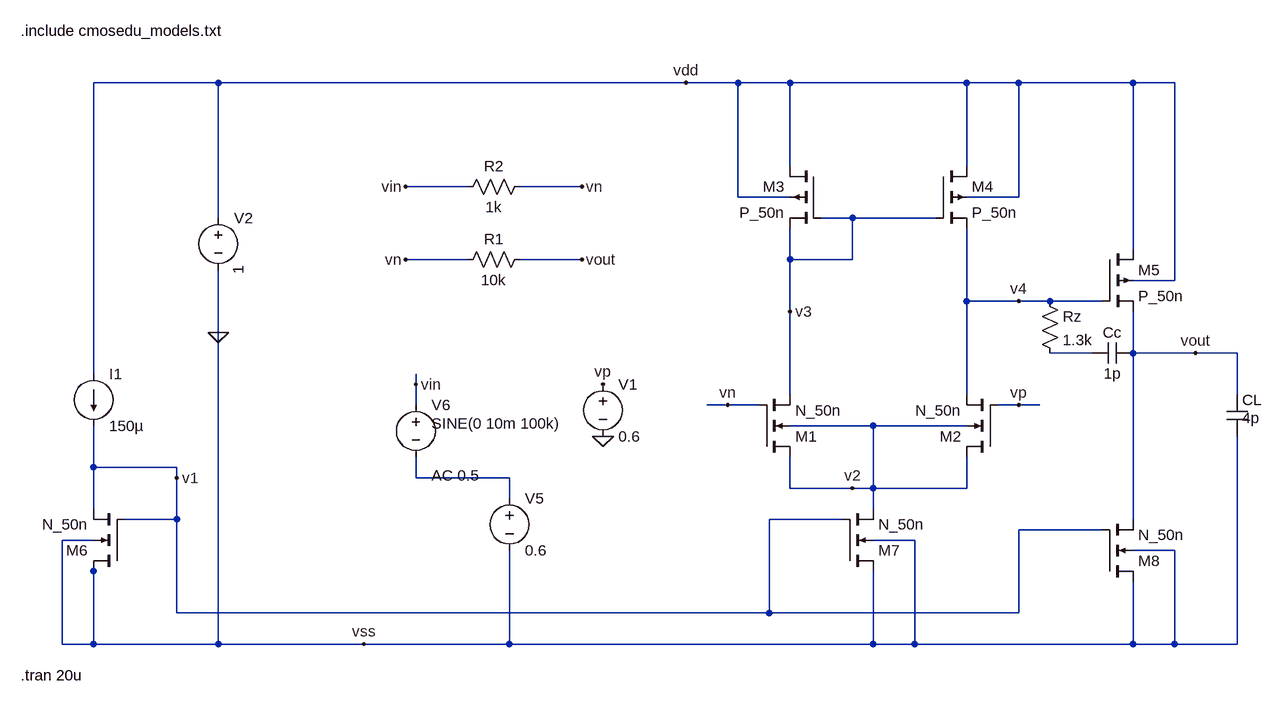
[diagram p0: schematic entregable_23_24_estudiantes.asc]
entregable_23_24_estudiantes.asc, the LTspice schematic file:
Version 4
SHEET 1 1968 1112
WIRE -176 -208 -368 -208
WIRE 544 -208 -176 -208
WIRE 624 -208 544 -208
WIRE 704 -208 624 -208
WIRE 976 -208 704 -208
WIRE 1056 -208 976 -208
WIRE 1232 -208 1056 -208
WIRE 1296 -208 1232 -208
WIRE 704 -80 704 -208
WIRE 976 -80 976 -208
WIRE 208 -48 112 -48
WIRE 384 -48 288 -48
WIRE 624 -32 624 -208
WIRE 704 -32 624 -32
WIRE 1056 -32 1056 -208
WIRE 1056 -32 976 -32
WIRE -176 0 -176 -208
WIRE 800 0 752 0
WIRE 928 0 800 0
WIRE 1232 48 1232 -208
WIRE 208 64 112 64
WIRE 384 64 288 64
WIRE 704 64 704 16
WIRE 800 64 800 0
WIRE 800 64 704 64
WIRE 1296 96 1296 -208
WIRE 1296 96 1232 96
WIRE 976 128 976 16
WIRE 1056 128 976 128
WIRE 1104 128 1056 128
WIRE 1184 128 1104 128
WIRE 704 144 704 64
WIRE -176 176 -176 80
WIRE 1168 208 1104 208
WIRE 1232 208 1232 144
WIRE 1328 208 1232 208
WIRE 1392 208 1328 208
WIRE -368 240 -368 -208
WIRE 128 256 128 240
WIRE 704 272 704 144
WIRE 976 272 976 128
WIRE 1392 272 1392 208
WIRE 128 288 128 256
WIRE 608 288 576 288
WIRE 656 288 608 288
WIRE 1056 288 1024 288
WIRE 1088 288 1056 288
WIRE 832 320 704 320
WIRE 976 320 832 320
WIRE -368 384 -368 320
WIRE -240 384 -368 384
WIRE -240 400 -240 384
WIRE 128 400 128 368
WIRE 272 400 128 400
WIRE 704 416 704 368
WIRE 800 416 704 416
WIRE 832 416 832 320
WIRE 832 416 800 416
WIRE 976 416 976 368
WIRE 976 416 832 416
WIRE 272 432 272 400
WIRE -368 448 -368 384
WIRE 832 448 832 416
WIRE -240 464 -240 400
WIRE -240 464 -320 464
WIRE 784 464 672 464
WIRE 1232 464 1232 208
WIRE 1184 480 1056 480
WIRE -368 496 -416 496
WIRE 896 496 832 496
WIRE 1296 512 1232 512
WIRE -368 544 -368 528
WIRE -240 608 -240 464
WIRE 672 608 672 464
WIRE 672 608 -240 608
WIRE 1056 608 1056 480
WIRE 1056 608 672 608
WIRE -416 656 -416 496
WIRE -368 656 -368 544
WIRE -368 656 -416 656
WIRE -176 656 -176 176
WIRE -176 656 -368 656
WIRE 48 656 -176 656
WIRE 272 656 272 512
WIRE 272 656 48 656
WIRE 832 656 832 544
WIRE 832 656 272 656
WIRE 896 656 896 496
WIRE 896 656 832 656
WIRE 1232 656 1232 560
WIRE 1232 656 896 656
WIRE 1296 656 1296 512
WIRE 1296 656 1232 656
WIRE 1392 656 1392 336
WIRE 1392 656 1296 656
FLAG 544 -208 vdd
FLAG -176 176 0
FLAG 48 656 vss
FLAG 128 256 vin
FLAG 1056 288 vp
FLAG 608 288 vn
FLAG 1328 208 vout
FLAG -240 400 v1
FLAG 800 416 v2
FLAG 704 144 v3
FLAG 1056 128 v4
FLAG 112 -48 vin
FLAG 384 -48 vn
FLAG 416 336 0
FLAG 416 256 vp
FLAG 112 64 vn
FLAG 384 64 vout
SYMBOL voltage -176 -16 R0
WINDOW 123 0 0 Left 2
WINDOW 39 0 0 Left 2
WINDOW 3 31 103 VLeft 2
SYMATTR Value 1
SYMATTR InstName V2
SYMBOL cap 1376 272 R0
WINDOW 3 24 36 Left 2
SYMATTR Value 4p
SYMATTR InstName CL
SYMBOL voltage 272 416 R0
WINDOW 123 0 0 Left 2
WINDOW 39 0 0 Left 2
SYMATTR InstName V5
SYMATTR Value 0.6
SYMBOL voltage 128 272 R0
WINDOW 123 24 124 Left 2
WINDOW 39 0 0 Left 2
WINDOW 3 24 44 Left 2
SYMATTR Value2 AC 0.5
SYMATTR InstName V6
SYMATTR Value SINE(0 10m 100k)
SYMBOL nmos4 656 368 M180
SYMATTR InstName M1
SYMATTR Value N_50n
SYMATTR Value2 l=200n w=34u
SYMBOL nmos4 1024 368 R180
SYMATTR InstName M2
SYMATTR Value N_50n
SYMATTR Value2 l=200n w=34u
SYMBOL pmos4 752 -80 M0
SYMATTR InstName M3
SYMATTR Value P_50n
SYMATTR Value2 l=200n w=102u
SYMBOL pmos4 928 -80 R0
SYMATTR InstName M4
SYMATTR Value P_50n
SYMATTR Value2 l=200n w=102u
SYMBOL nmos4 784 544 M180
SYMATTR InstName M7
SYMATTR Value N_50n
SYMATTR Value2 l=200n w=120u
SYMBOL current -368 240 R0
WINDOW 123 0 0 Left 0
WINDOW 39 0 0 Left 0
SYMATTR InstName I1
SYMATTR Value 150µ
SYMBOL nmos4 -320 544 R180
SYMATTR InstName M6
SYMATTR Value N_50n
SYMATTR Value2 l=200n w=18u
SYMBOL pmos4 1184 48 R0
SYMATTR InstName M5
SYMATTR Value P_50n
SYMATTR Value2 l=200n w=34u
SYMBOL nmos4 1184 560 M180
SYMATTR InstName M8
SYMATTR Value N_50n
SYMATTR Value2 l=200n w=18u
SYMBOL res 1088 112 R0
SYMATTR InstName Rz
SYMATTR Value 1.3k
SYMBOL cap 1232 192 R90
WINDOW 0 0 32 VBottom 2
WINDOW 3 32 32 VTop 2
SYMATTR InstName Cc
SYMATTR Value 1p
SYMBOL res 304 -64 R90
WINDOW 0 0 56 VBottom 2
WINDOW 3 32 56 VTop 2
SYMATTR InstName R2
SYMATTR Value 1k
SYMBOL voltage 416 240 R0
WINDOW 123 0 0 Left 0
WINDOW 39 0 0 Left 0
SYMATTR InstName V1
SYMATTR Value 0.6
SYMBOL res 304 48 R90
WINDOW 0 0 56 VBottom 2
WINDOW 3 32 56 VTop 2
SYMATTR InstName R1
SYMATTR Value 10k
TEXT -480 -288 Left 2 !.include cmosedu_models.txt
TEXT -480 704 Left 2 !.tran 20u

The netlist it stands for:
* entregable_23_24_estudiantes.asc
V2 vdd 0 1
CL vout 0 4p
V5 N002 0 0.6
V6 vin N002 SINE(0 10m 100k) AC 0.5
M1 v2 vn v3 v2 N_50n l=200n w=34u
M2 v2 vp v4 v2 N_50n l=200n w=34u
M3 vdd v3 v3 vdd P_50n l=200n w=102u
M4 vdd v3 v4 vdd P_50n l=200n w=102u
M7 0 v1 v2 0 N_50n l=200n w=120u
I1 vdd v1 150µ
M6 0 v1 v1 0 N_50n l=200n w=18u
M5 vdd v4 vout vdd P_50n l=200n w=34u
M8 0 v1 vout 0 N_50n l=200n w=18u
Rz v4 N001 1.3k
Cc vout N001 1p
R2 vn vin 1k
V1 vp 0 0.6
R1 vout vn 10k
.model NMOS NMOS
.model PMOS PMOS
.lib standard.mos
.include cmosedu_models.txt
.tran 20u
.backanno
.end